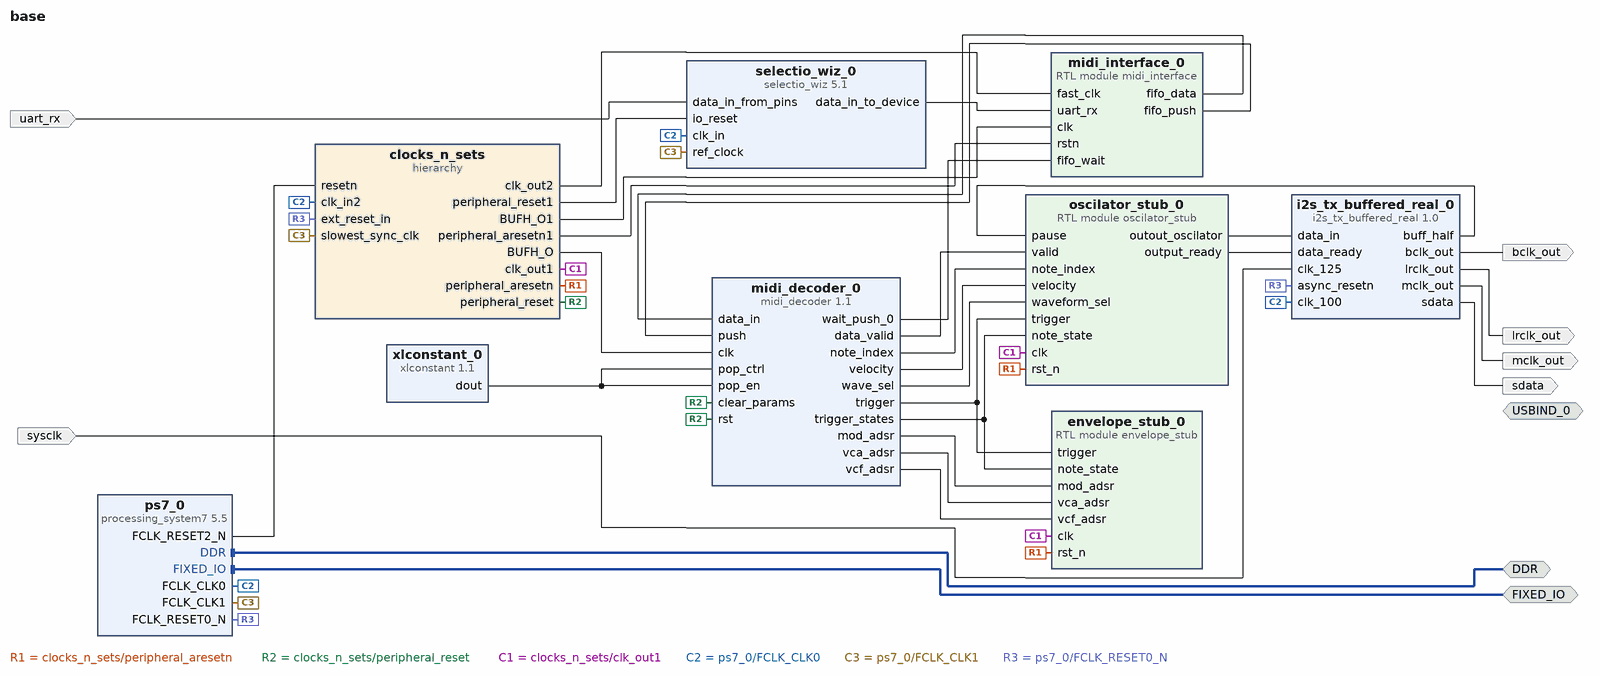
[diagram p0: block diagram of the top level]
# Vivado block design base, xc7z020clg400-1, Vivado 2021.1
create_bd_design base

create_bd_intf_port -mode Master -vlnv xilinx.com:interface:ddrx_rtl:1.0 DDR
create_bd_intf_port -mode Master -vlnv xilinx.com:display_processing_system7:fixedio_rtl:1.0 FIXED_IO
create_bd_intf_port -mode Master -vlnv xilinx.com:display_processing_system7:usbctrl_rtl:1.0 USBIND_0
create_bd_port -dir I -type clk sysclk
set_property -dict {CONFIG.FREQ_HZ 125000000} [get_bd_ports sysclk]
create_bd_port -dir O bclk_out
create_bd_port -dir O lrclk_out
create_bd_port -dir O sdata
create_bd_port -dir O -type clk mclk_out
create_bd_port -dir I uart_rx

create_bd_cell -type ip -vlnv xilinx.com:ip:processing_system7:5.5 ps7_0
set_property -dict [list \
  CONFIG.PCW_APU_PERIPHERAL_FREQMHZ 650 \
  CONFIG.PCW_CRYSTAL_PERIPHERAL_FREQMHZ 50 \
  CONFIG.PCW_ENET0_PERIPHERAL_ENABLE 0 \
  CONFIG.PCW_EN_CLK1_PORT 1 \
  CONFIG.PCW_EN_RST2_PORT 1 \
  CONFIG.PCW_FCLK3_PERIPHERAL_CLKSRC {ARM PLL} \
  CONFIG.PCW_FCLK_CLK1_BUF TRUE \
  CONFIG.PCW_FPGA0_PERIPHERAL_FREQMHZ 100 \
  CONFIG.PCW_FPGA1_PERIPHERAL_FREQMHZ 1 \
  CONFIG.PCW_FPGA2_PERIPHERAL_FREQMHZ 100 \
  CONFIG.PCW_FPGA3_PERIPHERAL_FREQMHZ 200 \
  CONFIG.PCW_FPGA_FCLK1_ENABLE 1 \
  CONFIG.PCW_GPIO_MIO_GPIO_ENABLE 0 \
  CONFIG.PCW_IRQ_F2P_INTR 1 \
  CONFIG.PCW_PERIPHERAL_BOARD_PRESET None \
  CONFIG.PCW_PRESET_BANK1_VOLTAGE {LVCMOS 1.8V} \
  CONFIG.PCW_QSPI_GRP_FBCLK_ENABLE 1 \
  CONFIG.PCW_QSPI_GRP_FBCLK_IO {MIO 8} \
  CONFIG.PCW_QSPI_GRP_SINGLE_SS_ENABLE 1 \
  CONFIG.PCW_QSPI_GRP_SINGLE_SS_IO {MIO 1 .. 6} \
  CONFIG.PCW_QSPI_PERIPHERAL_ENABLE 1 \
  CONFIG.PCW_QSPI_QSPI_IO {MIO 1 .. 6} \
  CONFIG.PCW_SD0_GRP_CD_ENABLE 1 \
  CONFIG.PCW_SD0_GRP_CD_IO {MIO 47} \
  CONFIG.PCW_SD0_GRP_WP_ENABLE 0 \
  CONFIG.PCW_SD0_PERIPHERAL_ENABLE 1 \
  CONFIG.PCW_SD0_SD0_IO {MIO 40 .. 45} \
  CONFIG.PCW_SDIO_PERIPHERAL_FREQMHZ 50 \
  CONFIG.PCW_SINGLE_QSPI_DATA_MODE x4 \
  CONFIG.PCW_UART1_PERIPHERAL_ENABLE 0 \
  CONFIG.PCW_UART_PERIPHERAL_FREQMHZ 100 \
  CONFIG.PCW_UIPARAM_DDR_BUS_WIDTH {16 Bit} \
  CONFIG.PCW_UIPARAM_DDR_FREQ_MHZ 525 \
  CONFIG.PCW_UIPARAM_DDR_PARTNO Custom \
  CONFIG.PCW_USB0_PERIPHERAL_ENABLE 0 \
  CONFIG.PCW_USE_FABRIC_INTERRUPT 1 \
  CONFIG.PCW_USE_M_AXI_GP0 0 \
] [get_bd_cells ps7_0]
# 417 more settings of ps7_0 are not shown: defaults, MIO pin electricals, DDR timing, and values the tool derives
create_bd_cell -type module -reference envelope_stub envelope_stub_0
create_bd_cell -type module -reference oscilator_stub oscilator_stub_0
create_bd_cell -type ip -vlnv xilinx.com:ip:xlconstant:1.1 xlconstant_0
set_property -dict {CONFIG.CONST_VAL 0} [get_bd_cells xlconstant_0]
create_bd_cell -type module -reference midi_interface midi_interface_0
create_bd_cell -type hier clocks_n_sets
create_bd_cell -type ip -vlnv xilinx.com:user:midi_decoder:1.1 midi_decoder_0
create_bd_cell -type ip -vlnv xilinx.com:user:i2s_tx_buffered_real:1.0 i2s_tx_buffered_real_0
create_bd_cell -type ip -vlnv xilinx.com:ip:selectio_wiz:5.1 selectio_wiz_0
set_property -dict [list \
  CONFIG.BUS_DIR INPUTS \
  CONFIG.BUS_IO_STD LVCMOS33 \
  CONFIG.BUS_SIG_TYPE SINGLE \
  CONFIG.CLK_FWD false \
  CONFIG.CLK_FWD_IO_STD LVCMOS33 \
  CONFIG.CLK_FWD_SIG_TYPE SINGLE \
  CONFIG.SELIO_ACTIVE_EDGE SDR \
  CONFIG.SELIO_BUS_IN_DELAY FIXED \
  CONFIG.SELIO_BUS_IN_TAP 8 \
  CONFIG.SELIO_CLK_BUF MMCM \
  CONFIG.SELIO_CLK_IO_STD LVCMOS33 \
  CONFIG.SELIO_CLK_SIG_TYPE SINGLE \
  CONFIG.SELIO_INTERFACE_TYPE NETWORKING \
  CONFIG.SERIALIZATION_FACTOR 4 \
  CONFIG.SYSTEM_DATA_WIDTH 1 \
  CONFIG.USE_SERIALIZATION false \
  CONFIG.USE_TEMPLATE Custom \
] [get_bd_cells selectio_wiz_0]

# ---- hierarchy /clocks_n_sets ----
current_bd_instance /clocks_n_sets
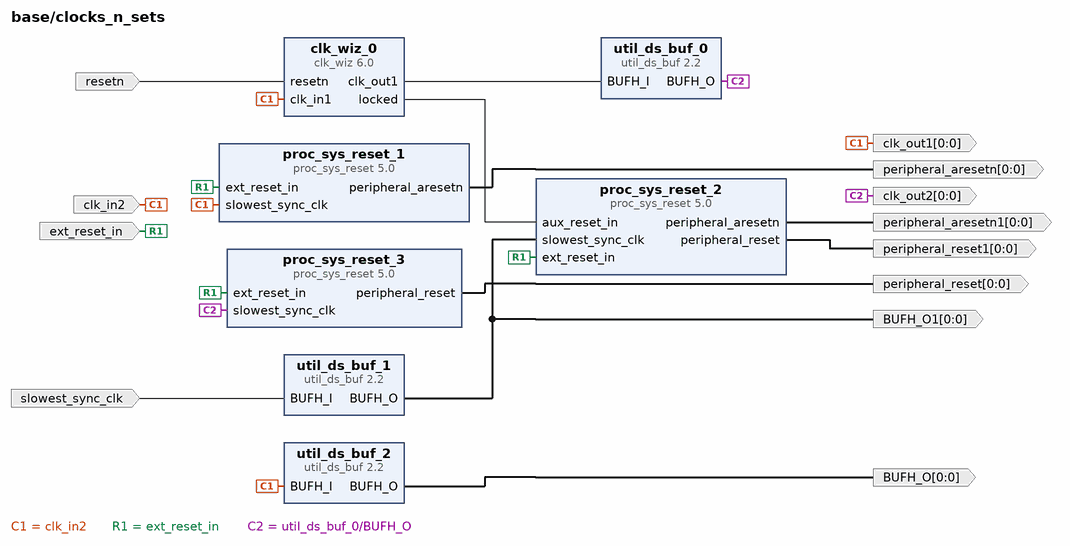
[diagram p1: block diagram inside /clocks_n_sets]
create_bd_pin -dir O -from 0 -to 0 -type clk clk_out1
create_bd_pin -dir I -type rst ext_reset_in
create_bd_pin -dir O -from 0 -to 0 -type rst peripheral_aresetn
create_bd_pin -dir I -type clk slowest_sync_clk
create_bd_pin -dir O -from 0 -to 0 -type rst peripheral_aresetn1
create_bd_pin -dir O -from 0 -to 0 -type clk clk_out2
create_bd_pin -dir O -from 0 -to 0 -type rst peripheral_reset
create_bd_pin -dir I -type rst resetn
create_bd_pin -dir I -type clk clk_in2
create_bd_pin -dir O -from 0 -to 0 BUFH_O
create_bd_pin -dir O -from 0 -to 0 BUFH_O1
create_bd_pin -dir O -from 0 -to 0 -type rst peripheral_reset1

create_bd_cell -type ip -vlnv xilinx.com:ip:proc_sys_reset:5.0 proc_sys_reset_1
set_property -dict {CONFIG.C_NUM_PERP_ARESETN 1} [get_bd_cells proc_sys_reset_1]
create_bd_cell -type ip -vlnv xilinx.com:ip:proc_sys_reset:5.0 proc_sys_reset_2
set_property -dict {CONFIG.C_NUM_PERP_ARESETN 1} [get_bd_cells proc_sys_reset_2]
create_bd_cell -type ip -vlnv xilinx.com:ip:proc_sys_reset:5.0 proc_sys_reset_3
set_property -dict {CONFIG.C_NUM_PERP_ARESETN 1} [get_bd_cells proc_sys_reset_3]
create_bd_cell -type ip -vlnv xilinx.com:ip:clk_wiz:6.0 clk_wiz_0
set_property -dict [list \
  CONFIG.CLKOUT1_DRIVES BUFG \
  CONFIG.CLKOUT1_JITTER 424.879 \
  CONFIG.CLKOUT1_PHASE_ERROR 864.369 \
  CONFIG.CLKOUT1_REQUESTED_OUT_FREQ 10 \
  CONFIG.CLKOUT1_USED true \
  CONFIG.CLKOUT2_DRIVES BUFG \
  CONFIG.CLKOUT3_DRIVES BUFG \
  CONFIG.CLKOUT4_DRIVES BUFG \
  CONFIG.CLKOUT5_DRIVES BUFG \
  CONFIG.CLKOUT6_DRIVES BUFG \
  CONFIG.CLKOUT7_DRIVES BUFG \
  CONFIG.FEEDBACK_SOURCE FDBK_AUTO \
  CONFIG.JITTER_SEL Max_I_Jitter \
  CONFIG.MMCM_BANDWIDTH LOW \
  CONFIG.MMCM_CLKFBOUT_MULT_F 41 \
  CONFIG.MMCM_CLKIN1_PERIOD 10.000 \
  CONFIG.MMCM_CLKIN2_PERIOD 10.000 \
  CONFIG.MMCM_CLKOUT0_DIVIDE_F 82 \
  CONFIG.MMCM_COMPENSATION INTERNAL \
  CONFIG.MMCM_DIVCLK_DIVIDE 5 \
  CONFIG.OVERRIDE_MMCM true \
  CONFIG.PRIMITIVE PLL \
  CONFIG.PRIM_IN_FREQ 100.0 \
  CONFIG.RESET_PORT resetn \
  CONFIG.RESET_TYPE ACTIVE_LOW \
  CONFIG.USE_SAFE_CLOCK_STARTUP false \
] [get_bd_cells clk_wiz_0]
create_bd_cell -type ip -vlnv xilinx.com:ip:util_ds_buf:2.2 util_ds_buf_0
set_property -dict {CONFIG.C_BUF_TYPE BUFH} [get_bd_cells util_ds_buf_0]
create_bd_cell -type ip -vlnv xilinx.com:ip:util_ds_buf:2.2 util_ds_buf_1
set_property -dict {CONFIG.C_BUF_TYPE BUFH} [get_bd_cells util_ds_buf_1]
create_bd_cell -type ip -vlnv xilinx.com:ip:util_ds_buf:2.2 util_ds_buf_2
set_property -dict {CONFIG.C_BUF_TYPE BUFH} [get_bd_cells util_ds_buf_2]

# ---- connections ----

current_bd_instance /clocks_n_sets
connect_bd_net [get_bd_pins clk_wiz_0/clk_out1] [get_bd_pins util_ds_buf_0/BUFH_I]
connect_bd_net [get_bd_pins clk_wiz_0/locked] [get_bd_pins proc_sys_reset_2/aux_reset_in]
connect_bd_net [get_bd_pins proc_sys_reset_1/peripheral_aresetn] [get_bd_pins peripheral_aresetn]
connect_bd_net [get_bd_pins proc_sys_reset_2/peripheral_aresetn] [get_bd_pins peripheral_aresetn1]
connect_bd_net [get_bd_pins proc_sys_reset_2/peripheral_reset] [get_bd_pins peripheral_reset1]
connect_bd_net [get_bd_pins proc_sys_reset_3/peripheral_reset] [get_bd_pins peripheral_reset]
connect_bd_net -net ps7_0_FCLK_CLK0 [get_bd_pins clk_in2] \
  [get_bd_pins clk_wiz_0/clk_in1] [get_bd_pins util_ds_buf_2/BUFH_I] [get_bd_pins proc_sys_reset_1/slowest_sync_clk] \
  [get_bd_pins clk_out1]
connect_bd_net -net ps7_0_FCLK_RESET0_N [get_bd_pins ext_reset_in] \
  [get_bd_pins proc_sys_reset_2/ext_reset_in] [get_bd_pins proc_sys_reset_3/ext_reset_in] \
  [get_bd_pins proc_sys_reset_1/ext_reset_in]
connect_bd_net -net ps7_0_FCLK_RESET2_N [get_bd_pins resetn] [get_bd_pins clk_wiz_0/resetn]
connect_bd_net [get_bd_pins slowest_sync_clk] [get_bd_pins util_ds_buf_1/BUFH_I]
connect_bd_net [get_bd_pins util_ds_buf_0/BUFH_O] [get_bd_pins proc_sys_reset_3/slowest_sync_clk] [get_bd_pins clk_out2]
connect_bd_net [get_bd_pins util_ds_buf_1/BUFH_O] [get_bd_pins proc_sys_reset_2/slowest_sync_clk] [get_bd_pins BUFH_O1]
connect_bd_net [get_bd_pins util_ds_buf_2/BUFH_O] [get_bd_pins BUFH_O]

current_bd_instance /
connect_bd_intf_net [get_bd_intf_ports DDR] [get_bd_intf_pins ps7_0/DDR]
connect_bd_intf_net [get_bd_intf_ports FIXED_IO] [get_bd_intf_pins ps7_0/FIXED_IO]
connect_bd_net -net clk_wiz_0_clk_out1 [get_bd_pins clocks_n_sets/clk_out2] [get_bd_pins midi_interface_0/fast_clk]
connect_bd_net [get_bd_pins clocks_n_sets/BUFH_O] [get_bd_pins midi_decoder_0/clk]
connect_bd_net [get_bd_pins clocks_n_sets/BUFH_O1] [get_bd_pins midi_interface_0/clk]
connect_bd_net [get_bd_pins clocks_n_sets/peripheral_reset1] [get_bd_pins selectio_wiz_0/io_reset]
connect_bd_net [get_bd_pins i2s_tx_buffered_real_0/bclk_out] [get_bd_ports bclk_out]
connect_bd_net [get_bd_pins i2s_tx_buffered_real_0/buff_half] [get_bd_pins oscilator_stub_0/pause]
connect_bd_net [get_bd_pins i2s_tx_buffered_real_0/lrclk_out] [get_bd_ports lrclk_out]
connect_bd_net [get_bd_pins i2s_tx_buffered_real_0/mclk_out] [get_bd_ports mclk_out]
connect_bd_net [get_bd_pins i2s_tx_buffered_real_0/sdata] [get_bd_ports sdata]
connect_bd_net -net midi_bd_0_trigger [get_bd_pins midi_decoder_0/trigger] \
  [get_bd_pins envelope_stub_0/trigger] [get_bd_pins oscilator_stub_0/trigger]
connect_bd_net -net midi_bd_0_trigger_states [get_bd_pins midi_decoder_0/trigger_states] \
  [get_bd_pins envelope_stub_0/note_state] [get_bd_pins oscilator_stub_0/note_state]
connect_bd_net [get_bd_pins midi_decoder_0/data_valid] [get_bd_pins oscilator_stub_0/valid]
connect_bd_net [get_bd_pins midi_decoder_0/mod_adsr] [get_bd_pins envelope_stub_0/mod_adsr]
connect_bd_net [get_bd_pins midi_decoder_0/note_index] [get_bd_pins oscilator_stub_0/note_index]
connect_bd_net [get_bd_pins midi_decoder_0/vca_adsr] [get_bd_pins envelope_stub_0/vca_adsr]
connect_bd_net [get_bd_pins midi_decoder_0/vcf_adsr] [get_bd_pins envelope_stub_0/vcf_adsr]
connect_bd_net [get_bd_pins midi_decoder_0/velocity] [get_bd_pins oscilator_stub_0/velocity]
connect_bd_net [get_bd_pins midi_decoder_0/wait_push_0] [get_bd_pins midi_interface_0/fifo_wait]
connect_bd_net [get_bd_pins midi_decoder_0/wave_sel] [get_bd_pins oscilator_stub_0/waveform_sel]
connect_bd_net [get_bd_pins midi_interface_0/fifo_data] [get_bd_pins midi_decoder_0/data_in]
connect_bd_net [get_bd_pins midi_interface_0/fifo_push] [get_bd_pins midi_decoder_0/push]
connect_bd_net [get_bd_pins oscilator_stub_0/outout_oscilator] [get_bd_pins i2s_tx_buffered_real_0/data_in]
connect_bd_net -net oscilator_stub_0_ready [get_bd_pins oscilator_stub_0/output_ready] [get_bd_pins i2s_tx_buffered_real_0/data_ready]
connect_bd_net -net proc_sys_reset_1_peripheral_aresetn [get_bd_pins clocks_n_sets/peripheral_aresetn] \
  [get_bd_pins envelope_stub_0/rst_n] [get_bd_pins oscilator_stub_0/rst_n]
connect_bd_net -net proc_sys_reset_2_peripheral_aresetn [get_bd_pins clocks_n_sets/peripheral_aresetn1] [get_bd_pins midi_interface_0/rstn]
connect_bd_net -net proc_sys_reset_3_peripheral_reset [get_bd_pins clocks_n_sets/peripheral_reset] \
  [get_bd_pins midi_decoder_0/clear_params] [get_bd_pins midi_decoder_0/rst]
connect_bd_net -net ps7_0_FCLK_CLK0 [get_bd_pins clocks_n_sets/clk_out1] [get_bd_pins envelope_stub_0/clk] [get_bd_pins oscilator_stub_0/clk]
connect_bd_net -net ps7_0_FCLK_CLK0_1 [get_bd_pins ps7_0/FCLK_CLK0] \
  [get_bd_pins clocks_n_sets/clk_in2] [get_bd_pins i2s_tx_buffered_real_0/clk_100] [get_bd_pins selectio_wiz_0/clk_in]
connect_bd_net [get_bd_pins ps7_0/FCLK_CLK1] [get_bd_pins clocks_n_sets/slowest_sync_clk] [get_bd_pins selectio_wiz_0/ref_clock]
connect_bd_net [get_bd_pins ps7_0/FCLK_RESET0_N] [get_bd_pins clocks_n_sets/ext_reset_in] [get_bd_pins i2s_tx_buffered_real_0/async_resetn]
connect_bd_net [get_bd_pins ps7_0/FCLK_RESET2_N] [get_bd_pins clocks_n_sets/resetn]
connect_bd_net [get_bd_ports sysclk] [get_bd_pins i2s_tx_buffered_real_0/clk_125]
connect_bd_net -net uart_rx_0_1 [get_bd_pins selectio_wiz_0/data_in_to_device] [get_bd_pins midi_interface_0/uart_rx]
connect_bd_net [get_bd_ports uart_rx] [get_bd_pins selectio_wiz_0/data_in_from_pins]
connect_bd_net [get_bd_pins xlconstant_0/dout] [get_bd_pins midi_decoder_0/pop_ctrl] [get_bd_pins midi_decoder_0/pop_en]
set_property HDL_ATTRIBUTE.BMM_INFO_PROCESSOR {arm > base iop_pmoda/mb_bram_ctrl base iop_pmodb/mb_bram_ctrl base iop_arduino/mb_bram_ctrl} [get_bd_cells ps7_0]
set_property HDL_ATTRIBUTE.KEEP_HIERARCHY yes [get_bd_cells ps7_0]
set_property PFM.AXI_PORT {  S_AXI_ACP {memport "S_AXI_ACP"}  S_AXI_HP1 {memport "S_AXI_HP"}  S_AXI_HP3 {memport "S_AXI_HP"}  } [get_bd_cells ps7_0]
set_property PFM.CLOCK {  FCLK_CLK0 {id "0" is_default "true"  proc_sys_reset "rst_ps7_0_fclk0" status "fixed"}  FCLK_CLK1 {id "1" is_default "false"  proc_sys_reset "rst_ps7_0_fclk1" status "fixed"}  FCLK_CLK3 {id "3" is_default "false"  proc_sys_reset "rst_ps7_0_fclk3" status "fixed"}  } [get_bd_cells ps7_0]

validate_bd_design
save_bd_design
